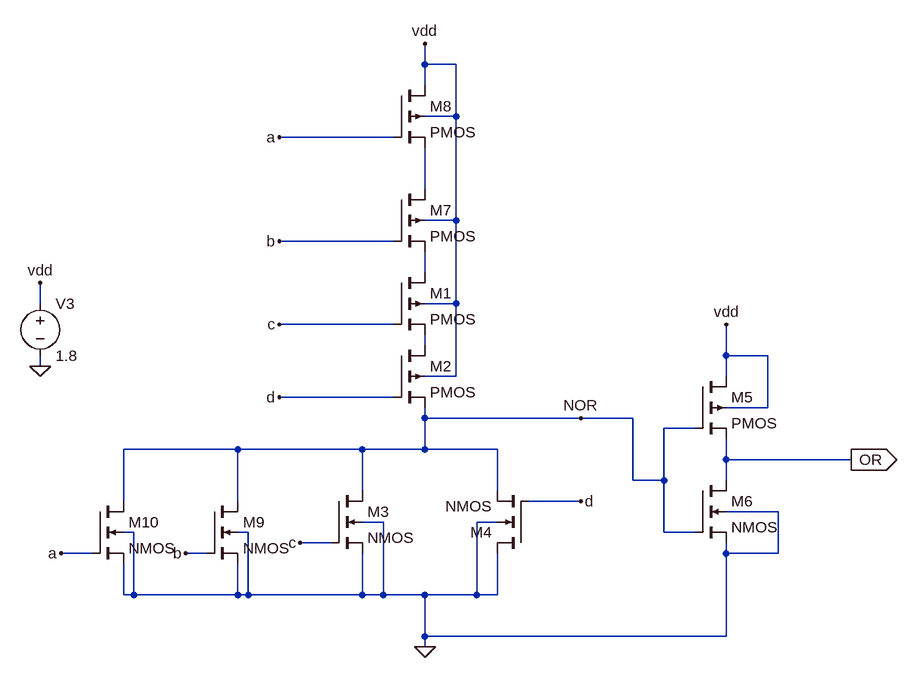
[diagram p0: schematic or_gate_4_input.asc]
or_gate_4_input.asc, the LTspice schematic file:
Version 4
SHEET 1 1016 680
WIRE 256 -432 256 -464
WIRE 304 -432 256 -432
WIRE 256 -400 256 -432
WIRE 304 -352 304 -432
WIRE 304 -352 256 -352
WIRE 208 -320 32 -320
WIRE 256 -240 256 -304
WIRE 304 -192 304 -352
WIRE 304 -192 256 -192
WIRE 208 -160 32 -160
WIRE 256 -112 256 -144
WIRE -336 -64 -336 -96
WIRE 304 -64 304 -192
WIRE 304 -64 256 -64
WIRE 208 -32 32 -32
WIRE 256 0 256 -16
WIRE 720 16 720 -32
WIRE 784 16 720 16
WIRE -336 32 -336 16
WIRE 304 48 304 -64
WIRE 304 48 256 48
WIRE 720 48 720 16
WIRE 208 80 32 80
WIRE 784 96 784 16
WIRE 784 96 720 96
WIRE 256 112 256 96
WIRE 496 112 256 112
WIRE 576 112 496 112
WIRE 672 128 624 128
WIRE -32 160 -208 160
WIRE 160 160 -32 160
WIRE 256 160 256 112
WIRE 256 160 160 160
WIRE 368 160 256 160
WIRE 720 176 720 144
WIRE 912 176 720 176
WIRE 576 208 576 112
WIRE 624 208 624 128
WIRE 624 208 576 208
WIRE 720 208 720 176
WIRE 160 224 160 160
WIRE 368 224 368 160
WIRE -208 240 -208 160
WIRE -32 240 -32 160
WIRE 496 240 416 240
WIRE 800 256 720 256
WIRE 192 272 160 272
WIRE 368 272 336 272
WIRE -192 288 -208 288
WIRE -16 288 -32 288
WIRE 624 288 624 208
WIRE 672 288 624 288
WIRE 112 304 64 304
WIRE -256 320 -304 320
WIRE -80 320 -112 320
WIRE 720 320 720 304
WIRE 800 320 800 256
WIRE 800 320 720 320
WIRE -208 384 -208 336
WIRE -192 384 -192 288
WIRE -192 384 -208 384
WIRE -32 384 -32 336
WIRE -32 384 -192 384
WIRE -16 384 -16 288
WIRE -16 384 -32 384
WIRE 160 384 160 320
WIRE 160 384 -16 384
WIRE 192 384 192 272
WIRE 192 384 160 384
WIRE 256 384 192 384
WIRE 336 384 336 272
WIRE 336 384 256 384
WIRE 368 384 368 320
WIRE 368 384 336 384
WIRE 256 448 256 384
WIRE 720 448 720 320
WIRE 720 448 256 448
WIRE 256 464 256 448
FLAG 256 464 0
FLAG -336 32 0
FLAG -336 -96 vdd
FLAG 720 -32 vdd
FLAG 496 112 NOR
FLAG 912 176 OR
IOPIN 912 176 Out
FLAG 256 -464 vdd
FLAG -304 320 a
FLAG -112 320 b
FLAG 64 304 c
FLAG 496 240 d
FLAG 32 -320 a
FLAG 32 -160 b
FLAG 32 -32 c
FLAG 32 80 d
SYMBOL pmos4 672 48 R0
SYMATTR InstName M5
SYMATTR Value2 l=1.8u w=2.18u
SYMBOL nmos4 672 208 R0
SYMATTR InstName M6
SYMATTR Value2 l=1.8u w=1u
SYMBOL voltage -336 -80 R0
WINDOW 123 0 0 Left 0
WINDOW 39 0 0 Left 0
SYMATTR InstName V3
SYMATTR Value 1.8
SYMBOL pmos4 208 -112 R0
SYMATTR InstName M1
SYMATTR Value2 l=1.8u w=4.36u
SYMBOL pmos4 208 0 R0
SYMATTR InstName M2
SYMATTR Value2 l=1.8u w=4.36u
SYMBOL nmos4 112 224 R0
SYMATTR InstName M3
SYMATTR Value2 l=1.8u w=1u
SYMBOL nmos4 416 320 R180
SYMATTR InstName M4
SYMATTR Value2 l=1.8u w=1u
SYMBOL pmos4 208 -240 R0
SYMATTR InstName M7
SYMBOL pmos4 208 -400 R0
SYMATTR InstName M8
SYMBOL nmos4 -80 240 R0
SYMATTR InstName M9
SYMBOL nmos4 -256 240 R0
SYMATTR InstName M10

The netlist it stands for:
* or_gate_4_input.asc
M5 vdd NOR OR vdd PMOS l=1.8u w=2.18u
M6 OR NOR 0 0 NMOS l=1.8u w=1u
V3 vdd 0 1.8
M1 N002 c N003 vdd PMOS l=1.8u w=4.36u
M2 N003 d NOR vdd PMOS l=1.8u w=4.36u
M3 NOR c 0 0 NMOS l=1.8u w=1u
M4 0 d NOR 0 NMOS l=1.8u w=1u
M7 N001 b N002 vdd PMOS
M8 vdd a N001 vdd PMOS
M9 NOR b 0 0 NMOS
M10 NOR a 0 0 NMOS
.model NMOS NMOS
.model PMOS PMOS
.lib standard.mos
.backanno
.end